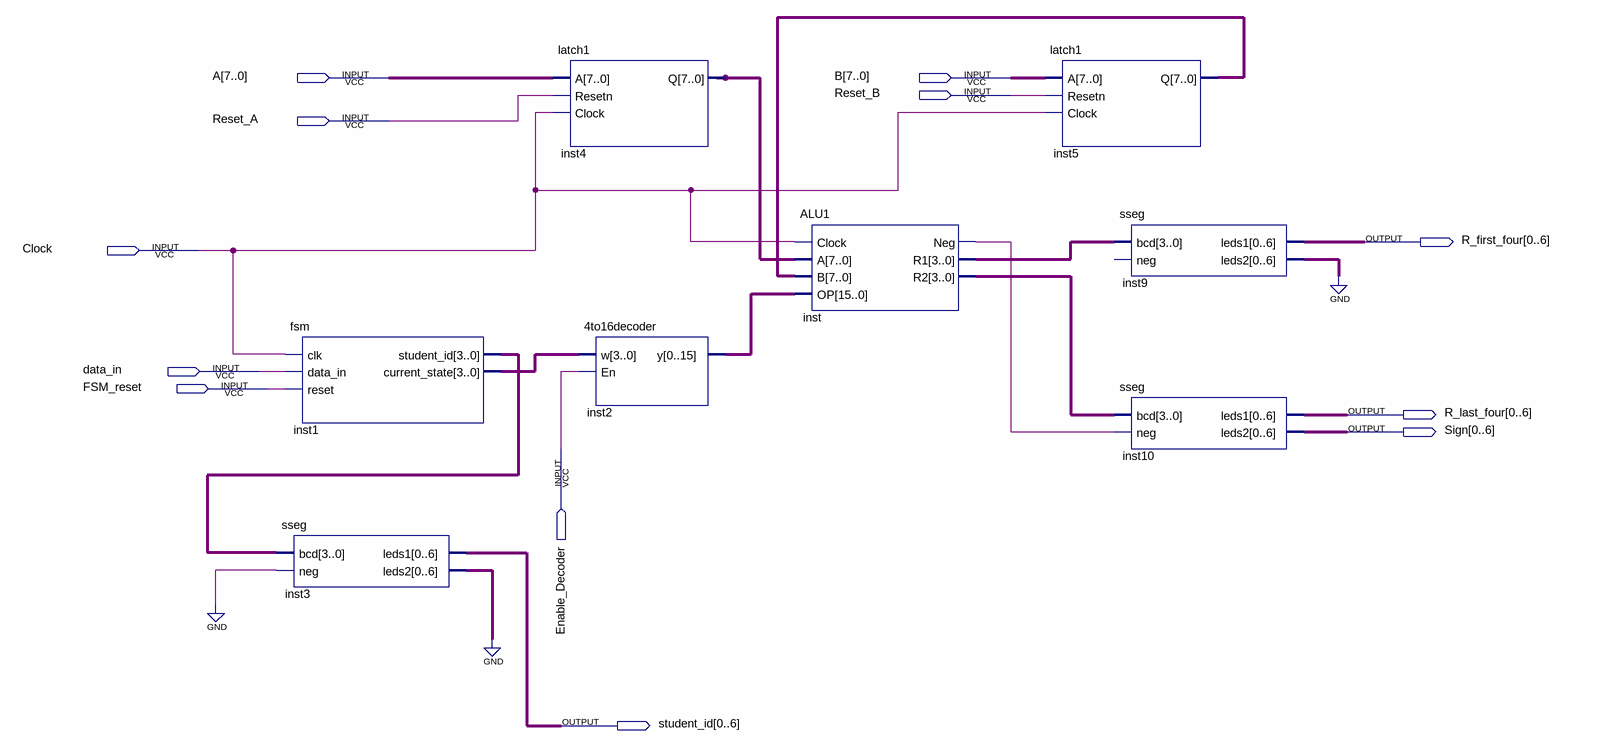
[diagram p0: schematic sheet]
// Quartus schematic problem1.bdf as structural Verilog: 8 symbols, 12 pins
module problem1 (
  input  [7:0] A,
  input  [7:0] B,
  input  Reset_B,
  input  Reset_A,
  input  Clock,
  input  data_in,
  input  FSM_reset,
  input  Enable_Decoder,
  output [0:6] R_first_four,
  output [0:6] R_last_four,
  output [0:6] Sign,
  output [0:6] student_id
);

  wire inst_neg;
  wire [3:0] inst1_current_state, inst1_student_id, inst_r1, inst_r2;
  wire [6:0] inst3_leds2, inst9_leds2;
  wire [7:0] inst4_q, inst5_q;
  wire [15:0] inst2_y;

  fsm inst1 (
    .clk(Clock), .data_in(data_in), .reset(FSM_reset), .student_id(inst1_student_id),
    .current_state(inst1_current_state));
  sseg inst3 (.bcd(inst1_student_id), .neg(1'b0), .leds1(student_id), .leds2(inst3_leds2));
  latch1 inst4 (.A(A), .Resetn(Reset_A), .Clock(Clock), .Q(inst4_q));
  \4to16decoder  inst2 (.w(inst1_current_state), .En(Enable_Decoder), .y(inst2_y));
  ALU1 inst (.Clock(Clock), .A(inst4_q), .B(inst5_q), .OP(inst2_y), .Neg(inst_neg), .R1(inst_r1), .R2(inst_r2));
  latch1 inst5 (.A(B), .Resetn(Reset_B), .Clock(Clock), .Q(inst5_q));
  sseg inst9 (.bcd(inst_r1), .leds1(R_first_four), .leds2(inst9_leds2));  // open: neg
  sseg inst10 (.bcd(inst_r2), .neg(inst_neg), .leds1(R_last_four), .leds2(Sign));
  // also tied to GND on the sheet: {inst3_leds2[0], inst3_leds2[1], inst3_leds2[2], inst3_leds2[3], inst3_leds2[4], inst3_leds2[5], inst3_leds2[6], inst9_leds2[0], inst9_leds2[1], inst9_leds2[2], inst9_leds2[3], inst9_leds2[4], inst9_leds2[5], inst9_leds2[6]}
endmodule
